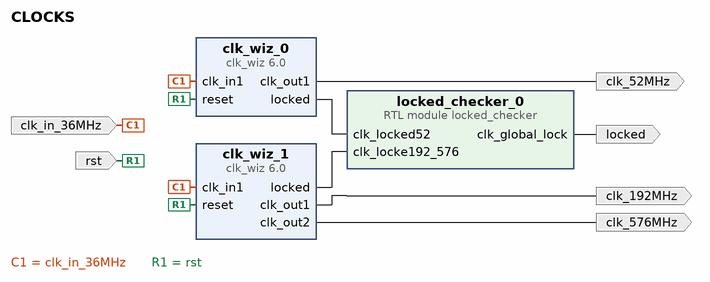
[diagram p0: block diagram of the top level]
# Vivado block design CLOCKS, xc7vx485tffg1157-1, Vivado 2021.2
create_bd_design CLOCKS

create_bd_port -dir O -type clk clk_192MHz
set_property -dict {CONFIG.FREQ_HZ 192000000} [get_bd_ports clk_192MHz]
create_bd_port -dir O -type clk clk_52MHz
set_property -dict {CONFIG.FREQ_HZ 52000000} [get_bd_ports clk_52MHz]
create_bd_port -dir O -type clk clk_576MHz
set_property -dict {CONFIG.FREQ_HZ 576000000} [get_bd_ports clk_576MHz]
create_bd_port -dir I -type clk clk_in_36MHz
set_property -dict {CONFIG.FREQ_HZ 36000000} [get_bd_ports clk_in_36MHz]
create_bd_port -dir O locked
create_bd_port -dir I -type rst rst
set_property -dict {CONFIG.POLARITY ACTIVE_HIGH} [get_bd_ports rst]

create_bd_cell -type ip -vlnv xilinx.com:ip:clk_wiz:6.0 clk_wiz_0
set_property -dict [list \
  CONFIG.CLKIN1_JITTER_PS 277.77000000000004 \
  CONFIG.CLKOUT1_JITTER 230.959 \
  CONFIG.CLKOUT1_PHASE_ERROR 199.468 \
  CONFIG.CLKOUT1_REQUESTED_OUT_FREQ 52 \
  CONFIG.MMCM_CLKFBOUT_MULT_F 27.625 \
  CONFIG.MMCM_CLKIN1_PERIOD 27.778 \
  CONFIG.MMCM_CLKIN2_PERIOD 10.0 \
  CONFIG.MMCM_CLKOUT0_DIVIDE_F 19.125 \
  CONFIG.MMCM_DIVCLK_DIVIDE 1 \
  CONFIG.PRIM_IN_FREQ 36 \
] [get_bd_cells clk_wiz_0]
create_bd_cell -type ip -vlnv xilinx.com:ip:clk_wiz:6.0 clk_wiz_1
set_property -dict [list \
  CONFIG.CLKIN1_JITTER_PS 277.77000000000004 \
  CONFIG.CLKOUT1_JITTER 151.084 \
  CONFIG.CLKOUT1_PHASE_ERROR 173.591 \
  CONFIG.CLKOUT1_REQUESTED_OUT_FREQ 192 \
  CONFIG.CLKOUT2_JITTER 129.300 \
  CONFIG.CLKOUT2_PHASE_ERROR 173.591 \
  CONFIG.CLKOUT2_REQUESTED_OUT_FREQ 576 \
  CONFIG.CLKOUT2_USED true \
  CONFIG.MMCM_CLKFBOUT_MULT_F 32.000 \
  CONFIG.MMCM_CLKIN1_PERIOD 27.778 \
  CONFIG.MMCM_CLKIN2_PERIOD 10.0 \
  CONFIG.MMCM_CLKOUT0_DIVIDE_F 6.000 \
  CONFIG.MMCM_CLKOUT1_DIVIDE 2 \
  CONFIG.MMCM_DIVCLK_DIVIDE 1 \
  CONFIG.NUM_OUT_CLKS 2 \
  CONFIG.PRIM_IN_FREQ 36 \
] [get_bd_cells clk_wiz_1]
create_bd_cell -type module -reference locked_checker locked_checker_0

# ---- connections ----

connect_bd_net [get_bd_ports clk_in_36MHz] [get_bd_pins clk_wiz_1/clk_in1] [get_bd_pins clk_wiz_0/clk_in1]
connect_bd_net [get_bd_pins clk_wiz_0/clk_out1] [get_bd_ports clk_52MHz]
connect_bd_net [get_bd_pins clk_wiz_0/locked] [get_bd_pins locked_checker_0/clk_locked52]
connect_bd_net [get_bd_pins clk_wiz_1/clk_out1] [get_bd_ports clk_192MHz]
connect_bd_net [get_bd_pins clk_wiz_1/clk_out2] [get_bd_ports clk_576MHz]
connect_bd_net [get_bd_pins clk_wiz_1/locked] [get_bd_pins locked_checker_0/clk_locke192_576]
connect_bd_net [get_bd_pins locked_checker_0/clk_global_lock] [get_bd_ports locked]
connect_bd_net [get_bd_ports rst] [get_bd_pins clk_wiz_0/reset] [get_bd_pins clk_wiz_1/reset]

validate_bd_design
save_bd_design
